# Altium schematic sheet Power_Distribution.SchDoc
size A
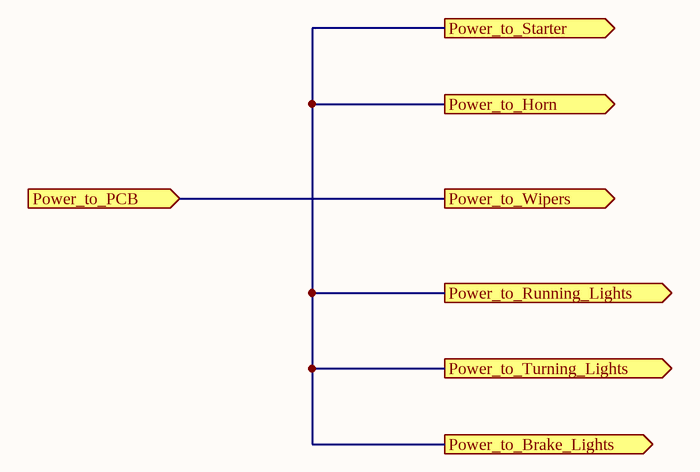
[diagram p0: Power_Distribution.SchDoc]

## Ports
Power_to_Brake_Lights (out), Power_to_Horn (out), Power_to_PCB (in), Power_to_Running_Lights (out), Power_to_Starter (out), Power_to_Turning_Lights (out), Power_to_Wipers (out)

## Nets
Power_to_Brake_Lights: port Power_to_Starter, port Power_to_Horn, port Power_to_Running_Lights, port Power_to_Turning_Lights, port Power_to_Brake_Lights
Power_to_PCB: port Power_to_PCB, port Power_to_Wipers